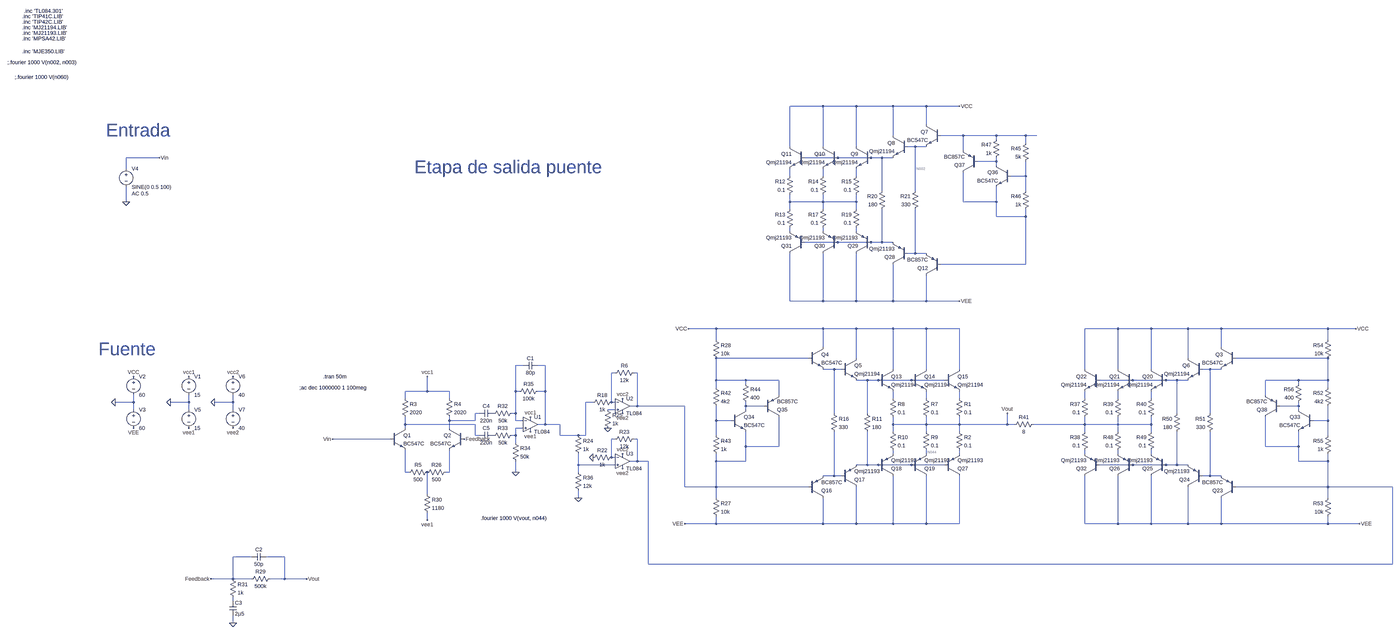
[diagram p0: schematic testV4.asc, whole sheet]
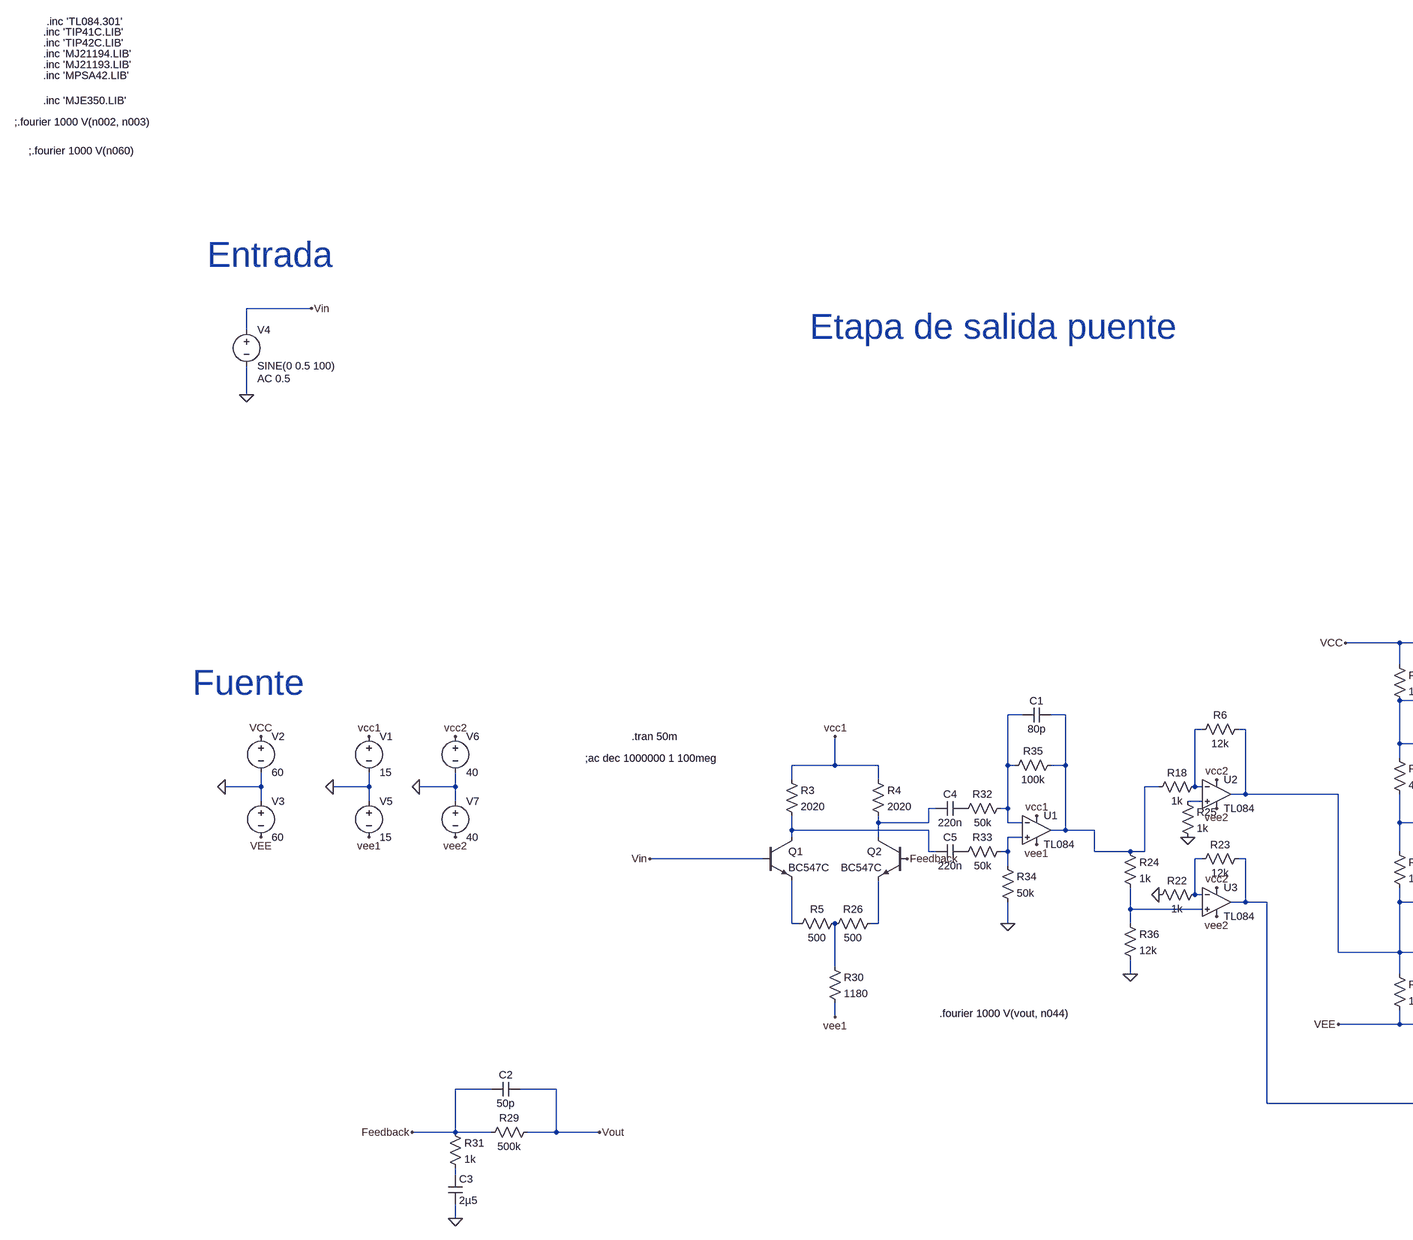
[diagram p1: schematic testV4.asc, part, row 1 of 1, column 1 of 2]
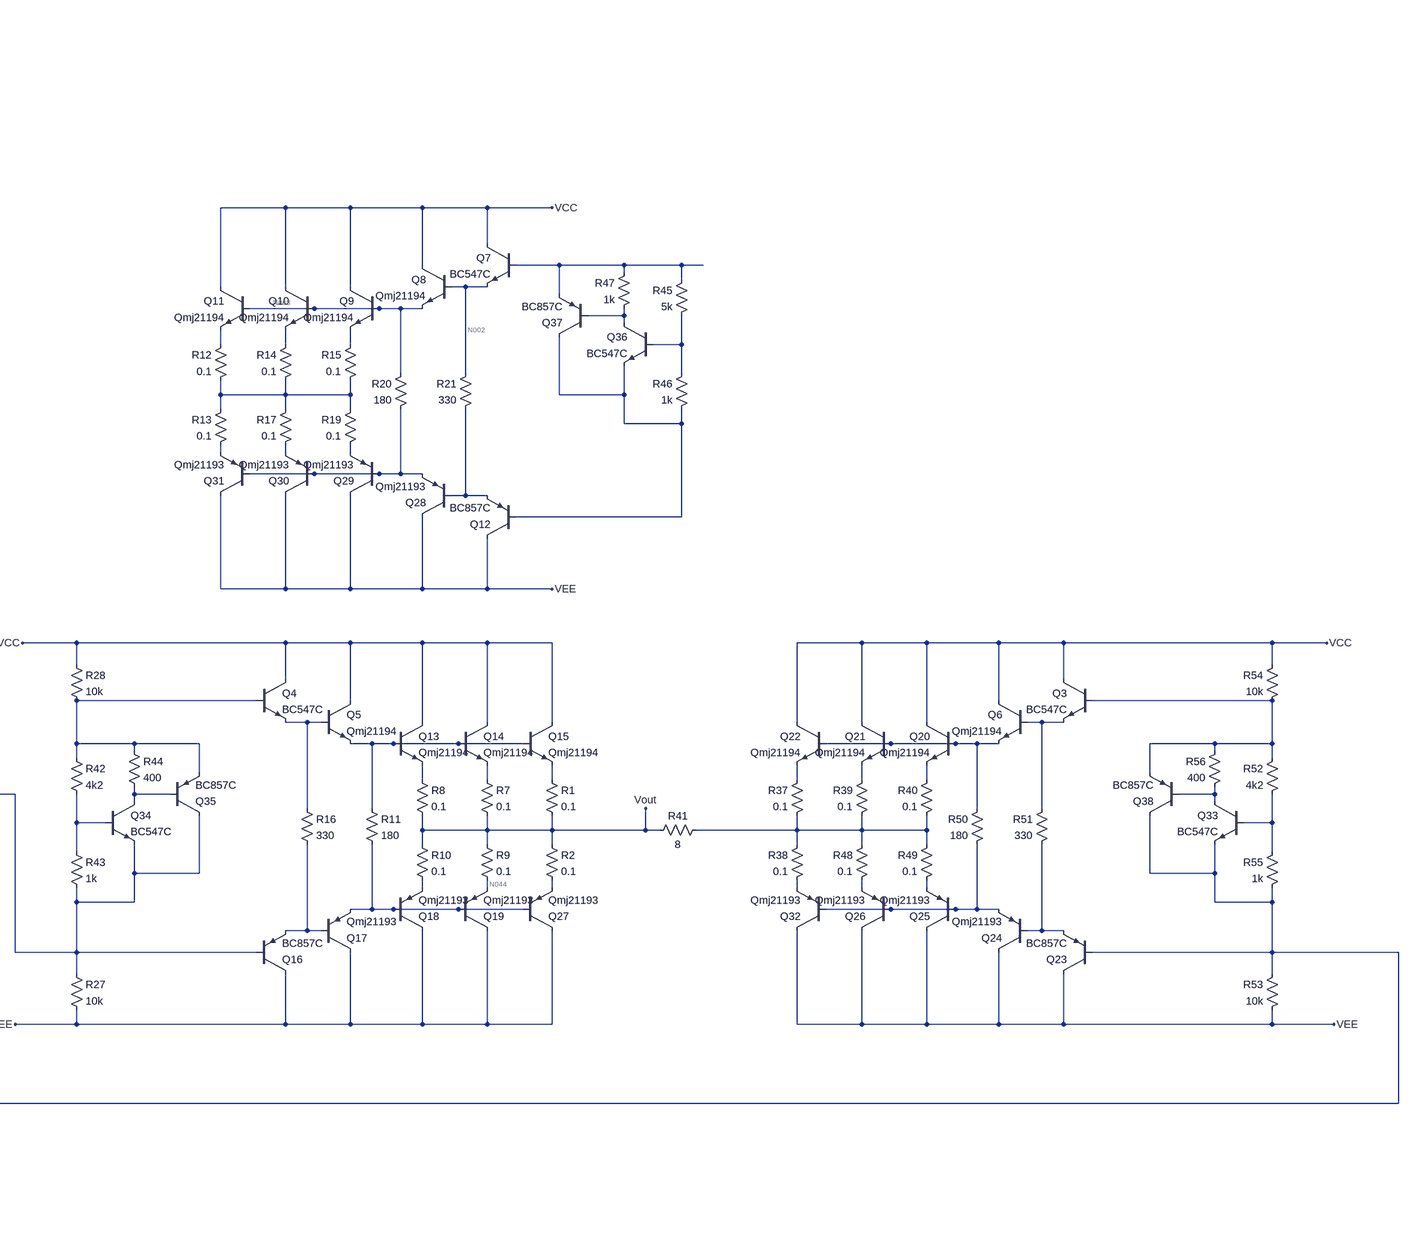
[diagram p2: schematic testV4.asc, part, row 1 of 1, column 2 of 2]
testV4.asc, the LTspice schematic file:
Version 4
SHEET 1 11584 2180
WIRE 6816 -288 6672 -288
WIRE 6960 -288 6816 -288
WIRE 7120 -288 6960 -288
WIRE 7264 -288 7120 -288
WIRE 7408 -288 7264 -288
WIRE 7264 -208 7264 -288
WIRE 7120 -160 7120 -288
WIRE 7424 -160 7328 -160
WIRE 7568 -160 7424 -160
WIRE 7696 -160 7568 -160
WIRE 7744 -160 7696 -160
WIRE 7568 -144 7568 -160
WIRE 7696 -128 7696 -160
WIRE 6672 -112 6672 -288
WIRE 6816 -112 6816 -288
WIRE 6960 -112 6960 -288
WIRE 7216 -112 7184 -112
WIRE 7264 -112 7216 -112
WIRE 7424 -96 7424 -160
WIRE 3760 -64 3616 -64
WIRE 6880 -64 6736 -64
WIRE 7024 -64 6880 -64
WIRE 7072 -64 7024 -64
WIRE 7120 -64 7072 -64
WIRE 7568 -48 7568 -64
WIRE 7568 -48 7488 -48
WIRE 7568 -32 7568 -48
WIRE 3616 -16 3616 -64
WIRE 6672 16 6672 -16
WIRE 6816 16 6816 -16
WIRE 6960 16 6960 -16
WIRE 7696 16 7696 -48
WIRE 7696 16 7632 16
WIRE 7072 80 7072 -64
WIRE 7216 80 7216 -112
WIRE 7696 80 7696 16
WIRE 3616 128 3616 64
WIRE 6672 128 6672 96
WIRE 6816 128 6816 96
WIRE 6816 128 6672 128
WIRE 6960 128 6960 96
WIRE 6960 128 6816 128
WIRE 7424 128 7424 0
WIRE 7568 128 7568 64
WIRE 7568 128 7424 128
WIRE 6672 160 6672 128
WIRE 6816 160 6816 128
WIRE 6960 160 6960 128
WIRE 7568 192 7568 128
WIRE 7696 192 7696 160
WIRE 7696 192 7568 192
WIRE 6672 256 6672 240
WIRE 6816 256 6816 240
WIRE 6960 256 6960 240
WIRE 6880 304 6736 304
WIRE 7024 304 6880 304
WIRE 7072 304 7072 160
WIRE 7072 304 7024 304
WIRE 7120 304 7072 304
WIRE 7216 352 7216 160
WIRE 7216 352 7184 352
WIRE 7264 352 7216 352
WIRE 7696 400 7696 192
WIRE 7696 400 7328 400
WIRE 6672 560 6672 352
WIRE 6816 560 6816 352
WIRE 6816 560 6672 560
WIRE 6960 560 6960 352
WIRE 6960 560 6816 560
WIRE 7120 560 7120 400
WIRE 7120 560 6960 560
WIRE 7264 560 7264 448
WIRE 7264 560 7120 560
WIRE 7408 560 7264 560
WIRE 6352 880 6208 880
WIRE 6816 880 6352 880
WIRE 6960 880 6816 880
WIRE 7120 880 6960 880
WIRE 7264 880 7120 880
WIRE 7408 880 7264 880
WIRE 8720 880 8576 880
WIRE 8864 880 8720 880
WIRE 9024 880 8864 880
WIRE 9168 880 9024 880
WIRE 9632 880 9168 880
WIRE 9776 880 9632 880
WIRE 6352 928 6352 880
WIRE 9632 928 9632 880
WIRE 6816 960 6816 880
WIRE 9168 960 9168 880
WIRE 6752 1008 6352 1008
WIRE 6960 1008 6960 880
WIRE 9024 1008 9024 880
WIRE 9632 1008 9232 1008
WIRE 5488 1040 5456 1040
WIRE 5584 1040 5552 1040
WIRE 6864 1056 6816 1056
WIRE 6896 1056 6864 1056
WIRE 7120 1056 7120 880
WIRE 7264 1056 7264 880
WIRE 7408 1056 7408 880
WIRE 8576 1056 8576 880
WIRE 8720 1056 8720 880
WIRE 8864 1056 8864 880
WIRE 9120 1056 9088 1056
WIRE 9168 1056 9120 1056
WIRE 5888 1072 5872 1072
WIRE 5984 1072 5968 1072
WIRE 6352 1104 6352 1008
WIRE 6480 1104 6352 1104
WIRE 6624 1104 6480 1104
WIRE 7008 1104 6960 1104
WIRE 7056 1104 7008 1104
WIRE 7200 1104 7056 1104
WIRE 7344 1104 7200 1104
WIRE 8784 1104 8640 1104
WIRE 8928 1104 8784 1104
WIRE 8976 1104 8928 1104
WIRE 9024 1104 8976 1104
WIRE 9504 1104 9360 1104
WIRE 9632 1104 9632 1008
WIRE 9632 1104 9504 1104
WIRE 6480 1120 6480 1104
WIRE 9504 1120 9504 1104
WIRE 6352 1136 6352 1104
WIRE 9632 1136 9632 1104
WIRE 5072 1152 5072 1088
WIRE 5072 1152 4976 1152
WIRE 5168 1152 5072 1152
WIRE 5456 1152 5456 1040
WIRE 5472 1152 5456 1152
WIRE 5584 1152 5584 1040
WIRE 5584 1152 5552 1152
WIRE 6624 1168 6624 1104
WIRE 9360 1168 9360 1104
WIRE 4976 1184 4976 1152
WIRE 5168 1184 5168 1152
WIRE 7120 1184 7120 1152
WIRE 7264 1184 7264 1152
WIRE 7408 1184 7408 1152
WIRE 8576 1184 8576 1152
WIRE 8720 1184 8720 1152
WIRE 8864 1184 8864 1152
WIRE 3648 1200 3648 1168
WIRE 3648 1200 3568 1200
WIRE 3888 1200 3888 1168
WIRE 3888 1200 3808 1200
WIRE 4080 1200 4080 1168
WIRE 4080 1200 4000 1200
WIRE 5792 1200 5760 1200
WIRE 5872 1200 5872 1072
WIRE 5888 1200 5872 1200
WIRE 5984 1216 5984 1072
WIRE 5984 1216 5952 1216
WIRE 6192 1216 5984 1216
WIRE 6480 1216 6480 1200
WIRE 6560 1216 6480 1216
WIRE 9504 1216 9504 1200
WIRE 9504 1216 9424 1216
WIRE 3648 1232 3648 1200
WIRE 3888 1232 3888 1200
WIRE 4080 1232 4080 1200
WIRE 5888 1232 5856 1232
WIRE 6480 1232 6480 1216
WIRE 9504 1232 9504 1216
WIRE 5296 1248 5280 1248
WIRE 5456 1248 5456 1152
WIRE 5456 1248 5440 1248
WIRE 6864 1248 6864 1056
WIRE 7008 1248 7008 1104
WIRE 8976 1248 8976 1104
WIRE 9120 1248 9120 1056
WIRE 5168 1280 5168 1264
WIRE 5280 1280 5280 1248
WIRE 5280 1280 5168 1280
WIRE 5456 1280 5456 1248
WIRE 5488 1280 5456 1280
WIRE 6352 1280 6352 1216
WIRE 6416 1280 6352 1280
WIRE 9632 1280 9632 1216
WIRE 9632 1280 9568 1280
WIRE 4976 1296 4976 1264
WIRE 5280 1296 4976 1296
WIRE 5584 1296 5584 1152
WIRE 5584 1296 5552 1296
WIRE 5648 1296 5584 1296
WIRE 7120 1296 7120 1264
WIRE 7264 1296 7264 1264
WIRE 7264 1296 7120 1296
WIRE 7408 1296 7408 1264
WIRE 7408 1296 7264 1296
WIRE 7616 1296 7616 1248
WIRE 7616 1296 7408 1296
WIRE 7648 1296 7616 1296
WIRE 8576 1296 8576 1264
WIRE 8576 1296 7728 1296
WIRE 8720 1296 8720 1264
WIRE 8720 1296 8576 1296
WIRE 8864 1296 8864 1264
WIRE 8864 1296 8720 1296
WIRE 4976 1312 4976 1296
WIRE 5168 1312 5168 1280
WIRE 5488 1312 5456 1312
WIRE 7120 1328 7120 1296
WIRE 7264 1328 7264 1296
WIRE 7408 1328 7408 1296
WIRE 8576 1328 8576 1296
WIRE 8720 1328 8720 1296
WIRE 8864 1328 8864 1296
WIRE 5280 1344 5280 1296
WIRE 5296 1344 5280 1344
WIRE 5456 1344 5456 1312
WIRE 5456 1344 5440 1344
WIRE 5648 1344 5648 1296
WIRE 5728 1344 5648 1344
WIRE 5760 1344 5760 1200
WIRE 5760 1344 5728 1344
WIRE 6352 1344 6352 1280
WIRE 9632 1344 9632 1280
WIRE 4912 1360 4512 1360
WIRE 5888 1360 5872 1360
WIRE 5984 1360 5968 1360
WIRE 5456 1376 5456 1344
WIRE 6480 1392 6480 1328
WIRE 6624 1392 6624 1264
WIRE 6624 1392 6480 1392
WIRE 9360 1392 9360 1264
WIRE 9504 1392 9504 1328
WIRE 9504 1392 9360 1392
WIRE 7120 1424 7120 1408
WIRE 7264 1424 7264 1408
WIRE 7408 1424 7408 1408
WIRE 8576 1424 8576 1408
WIRE 8720 1424 8720 1408
WIRE 8864 1424 8864 1408
WIRE 5872 1440 5872 1360
WIRE 5888 1440 5872 1440
WIRE 5984 1456 5984 1360
WIRE 5984 1456 5952 1456
WIRE 6032 1456 5984 1456
WIRE 6352 1456 6352 1424
WIRE 6480 1456 6480 1392
WIRE 6480 1456 6352 1456
WIRE 9504 1456 9504 1392
WIRE 9632 1456 9632 1424
WIRE 9632 1456 9504 1456
WIRE 5728 1472 5728 1424
WIRE 5888 1472 5728 1472
WIRE 7008 1472 7008 1328
WIRE 7008 1472 6960 1472
WIRE 7056 1472 7008 1472
WIRE 7200 1472 7056 1472
WIRE 7344 1472 7200 1472
WIRE 8784 1472 8640 1472
WIRE 8928 1472 8784 1472
WIRE 8976 1472 8976 1328
WIRE 8976 1472 8928 1472
WIRE 9024 1472 8976 1472
WIRE 4976 1504 4976 1408
WIRE 4992 1504 4976 1504
WIRE 5168 1504 5168 1408
WIRE 5168 1504 5152 1504
WIRE 5456 1504 5456 1456
WIRE 5728 1504 5728 1472
WIRE 6864 1520 6864 1328
WIRE 6864 1520 6816 1520
WIRE 6896 1520 6864 1520
WIRE 9120 1520 9120 1328
WIRE 9120 1520 9088 1520
WIRE 9168 1520 9120 1520
WIRE 6192 1568 6192 1216
WIRE 6352 1568 6352 1456
WIRE 6352 1568 6192 1568
WIRE 6752 1568 6352 1568
WIRE 9632 1568 9632 1456
WIRE 9632 1568 9232 1568
WIRE 9936 1568 9632 1568
WIRE 5072 1600 5072 1504
WIRE 5728 1616 5728 1584
WIRE 6352 1616 6352 1568
WIRE 9632 1616 9632 1568
WIRE 5072 1712 5072 1680
WIRE 6352 1728 6352 1696
WIRE 6352 1728 6192 1728
WIRE 6816 1728 6816 1616
WIRE 6816 1728 6352 1728
WIRE 6960 1728 6960 1568
WIRE 6960 1728 6816 1728
WIRE 7120 1728 7120 1520
WIRE 7120 1728 6960 1728
WIRE 7264 1728 7264 1520
WIRE 7264 1728 7120 1728
WIRE 7408 1728 7408 1520
WIRE 7408 1728 7264 1728
WIRE 8576 1728 8576 1520
WIRE 8720 1728 8720 1520
WIRE 8720 1728 8576 1728
WIRE 8864 1728 8864 1520
WIRE 8864 1728 8720 1728
WIRE 9024 1728 9024 1568
WIRE 9024 1728 8864 1728
WIRE 9168 1728 9168 1616
WIRE 9168 1728 9024 1728
WIRE 9632 1728 9632 1696
WIRE 9632 1728 9168 1728
WIRE 9792 1728 9632 1728
WIRE 4160 1872 4080 1872
WIRE 4304 1872 4224 1872
WIRE 6032 1904 6032 1456
WIRE 9936 1904 9936 1568
WIRE 9936 1904 6032 1904
WIRE 4080 1968 4080 1872
WIRE 4080 1968 3984 1968
WIRE 4160 1968 4080 1968
WIRE 4304 1968 4304 1872
WIRE 4304 1968 4240 1968
WIRE 4400 1968 4304 1968
WIRE 4080 2064 4080 2048
WIRE 4080 2160 4080 2128
FLAG 4080 2160 0
FLAG 3568 1200 0
FLAG 3616 128 0
FLAG 3760 -64 Vin
FLAG 3648 1088 VCC
FLAG 6208 880 VCC
FLAG 7408 -288 VCC
FLAG 3648 1312 VEE
FLAG 6192 1728 VEE
FLAG 7408 560 VEE
FLAG 3984 1968 Feedback
FLAG 4400 1968 Vout
FLAG 7616 1248 Vout
FLAG 4512 1360 Vin
FLAG 3808 1200 0
FLAG 3888 1088 vcc1
FLAG 3888 1312 vee1
FLAG 5856 1312 0
FLAG 5792 1440 0
FLAG 5072 1712 vee1
FLAG 5520 1328 vee1
FLAG 5920 1488 vee2
FLAG 5920 1248 vee2
FLAG 5072 1088 vcc1
FLAG 5520 1264 vcc1
FLAG 5920 1184 vcc2
FLAG 5920 1424 vcc2
FLAG 5456 1504 0
FLAG 4000 1200 0
FLAG 4080 1088 vcc2
FLAG 4080 1312 vee2
FLAG 5728 1616 0
FLAG 5232 1360 Feedback
FLAG 9776 880 VCC
FLAG 9792 1728 VEE
SYMBOL res 4256 1952 R90
WINDOW 0 0 56 VBottom 2
WINDOW 3 32 56 VTop 2
SYMATTR InstName R29
SYMATTR Value 500k
SYMBOL res 4064 1952 R0
SYMATTR InstName R31
SYMATTR Value 1k
SYMBOL cap 4224 1856 R90
WINDOW 0 0 32 VBottom 2
WINDOW 3 32 32 VTop 2
SYMATTR InstName C2
SYMATTR Value 50p
SYMBOL cap 4064 2064 R0
SYMATTR InstName C3
SYMATTR Value 2µ5
SYMBOL npn 6752 960 R0
SYMATTR InstName Q4
SYMATTR Value BC547C
SYMBOL npn 6896 1008 R0
SYMATTR InstName Q5
SYMATTR Value Qmj21194
SYMBOL npn 7056 1056 R0
SYMATTR InstName Q13
SYMATTR Value Qmj21194
SYMBOL npn 7200 1056 R0
SYMATTR InstName Q14
SYMATTR Value Qmj21194
SYMBOL npn 7344 1056 R0
SYMATTR InstName Q15
SYMATTR Value Qmj21194
SYMBOL pnp 6752 1616 M180
SYMATTR InstName Q16
SYMATTR Value BC857C
SYMBOL pnp 6896 1568 M180
SYMATTR InstName Q17
SYMATTR Value Qmj21193
SYMBOL pnp 7056 1520 M180
SYMATTR InstName Q18
SYMATTR Value Qmj21193
SYMBOL pnp 7200 1520 M180
SYMATTR InstName Q19
SYMATTR Value Qmj21193
SYMBOL pnp 7344 1520 M180
SYMATTR InstName Q27
SYMATTR Value Qmj21193
SYMBOL res 7392 1168 R0
SYMATTR InstName R1
SYMATTR Value 0.1
SYMBOL res 7392 1312 R0
SYMATTR InstName R2
SYMATTR Value 0.1
SYMBOL res 7248 1168 R0
SYMATTR InstName R7
SYMATTR Value 0.1
SYMBOL res 7104 1168 R0
SYMATTR InstName R8
SYMATTR Value 0.1
SYMBOL res 7248 1312 R0
SYMATTR InstName R9
SYMATTR Value 0.1
SYMBOL res 7104 1312 R0
SYMATTR InstName R10
SYMATTR Value 0.1
SYMBOL res 6992 1232 R0
SYMATTR InstName R11
SYMATTR Value 180
SYMBOL res 6848 1232 R0
SYMATTR InstName R16
SYMATTR Value 330
SYMBOL npn 7328 -208 M0
SYMATTR InstName Q7
SYMATTR Value BC547C
SYMBOL npn 7184 -160 M0
SYMATTR InstName Q8
SYMATTR Value Qmj21194
SYMBOL npn 7024 -112 M0
SYMATTR InstName Q9
SYMATTR Value Qmj21194
SYMBOL npn 6880 -112 M0
SYMATTR InstName Q10
SYMATTR Value Qmj21194
SYMBOL npn 6736 -112 M0
SYMATTR InstName Q11
SYMATTR Value Qmj21194
SYMBOL pnp 7328 448 R180
SYMATTR InstName Q12
SYMATTR Value BC857C
SYMBOL pnp 7184 400 R180
SYMATTR InstName Q28
SYMATTR Value Qmj21193
SYMBOL pnp 7024 352 R180
SYMATTR InstName Q29
SYMATTR Value Qmj21193
SYMBOL pnp 6880 352 R180
SYMATTR InstName Q30
SYMATTR Value Qmj21193
SYMBOL pnp 6736 352 R180
SYMATTR InstName Q31
SYMATTR Value Qmj21193
SYMBOL res 6688 0 M0
SYMATTR InstName R12
SYMATTR Value 0.1
SYMBOL res 6688 144 M0
SYMATTR InstName R13
SYMATTR Value 0.1
SYMBOL res 6832 0 M0
SYMATTR InstName R14
SYMATTR Value 0.1
SYMBOL res 6976 0 M0
SYMATTR InstName R15
SYMATTR Value 0.1
SYMBOL res 6832 144 M0
SYMATTR InstName R17
SYMATTR Value 0.1
SYMBOL res 6976 144 M0
SYMATTR InstName R19
SYMATTR Value 0.1
SYMBOL res 7088 64 M0
SYMATTR InstName R20
SYMATTR Value 180
SYMBOL res 7232 64 M0
SYMATTR InstName R21
SYMATTR Value 330
SYMBOL res 7744 1280 R90
WINDOW 0 0 56 VBottom 2
WINDOW 3 32 56 VTop 2
SYMATTR InstName R41
SYMATTR Value 8
SYMBOL npn 6416 1232 R0
SYMATTR InstName Q34
SYMATTR Value BC547C
SYMBOL res 6336 1120 R0
SYMATTR InstName R42
SYMATTR Value 4k2
SYMBOL res 6336 1328 R0
SYMATTR InstName R43
SYMATTR Value 1k
SYMBOL res 6464 1104 R0
SYMATTR InstName R44
SYMATTR Value 400
SYMBOL pnp 6560 1264 M180
SYMATTR InstName Q35
SYMATTR Value BC857C
SYMBOL npn 7632 -32 M0
SYMATTR InstName Q36
SYMATTR Value BC547C
SYMBOL res 7712 -144 M0
SYMATTR InstName R45
SYMATTR Value 5k
SYMBOL res 7712 64 M0
SYMATTR InstName R46
SYMATTR Value 1k
SYMBOL res 7584 -160 M0
SYMATTR InstName R47
SYMATTR Value 1k
SYMBOL pnp 7488 0 R180
SYMATTR InstName Q37
SYMATTR Value BC857C
SYMBOL voltage 3648 1072 R0
WINDOW 123 0 0 Left 0
WINDOW 39 24 44 Left 2
SYMATTR InstName V2
SYMATTR Value 60
SYMBOL voltage 3648 1216 R0
WINDOW 123 0 0 Left 0
WINDOW 39 24 124 Left 2
SYMATTR InstName V3
SYMATTR Value 60
SYMBOL voltage 3616 -32 R0
WINDOW 123 24 124 Left 2
WINDOW 39 0 0 Left 0
SYMATTR Value2 AC 0.5
SYMATTR InstName V4
SYMATTR Value SINE(0 0.5 100)
SYMBOL voltage 3888 1072 R0
WINDOW 123 0 0 Left 0
WINDOW 39 24 44 Left 2
SYMATTR InstName V1
SYMATTR Value 15
SYMBOL voltage 3888 1216 R0
WINDOW 123 0 0 Left 0
WINDOW 39 24 124 Left 2
SYMATTR InstName V5
SYMATTR Value 15
SYMBOL Opamps\\opamp2 5920 1152 R0
SYMATTR InstName U2
SYMATTR Value TL084
SYMBOL Opamps\\opamp2 5920 1392 R0
SYMATTR InstName U3
SYMATTR Value TL084
SYMBOL res 5984 1056 R90
WINDOW 0 0 56 VBottom 2
WINDOW 3 32 56 VTop 2
SYMATTR InstName R6
SYMATTR Value 12k
SYMBOL res 5888 1184 R90
WINDOW 0 0 56 VBottom 2
WINDOW 3 32 56 VTop 2
SYMATTR InstName R18
SYMATTR Value 1k
SYMBOL res 5888 1424 R90
WINDOW 0 0 56 VBottom 2
WINDOW 3 32 56 VTop 2
SYMATTR InstName R22
SYMATTR Value 1k
SYMBOL res 5984 1344 R90
WINDOW 0 0 56 VBottom 2
WINDOW 3 32 56 VTop 2
SYMATTR InstName R23
SYMATTR Value 12k
SYMBOL res 5712 1328 R0
SYMATTR InstName R24
SYMATTR Value 1k
SYMBOL res 5840 1216 R0
SYMATTR InstName R25
SYMATTR Value 1k
SYMBOL npn 4912 1312 R0
SYMATTR InstName Q1
SYMATTR Value BC547C
SYMBOL npn 5232 1312 M0
SYMATTR InstName Q2
SYMATTR Value BC547C
SYMBOL res 4960 1168 R0
SYMATTR InstName R3
SYMATTR Value 2020
SYMBOL res 5152 1168 R0
SYMATTR InstName R4
SYMATTR Value 2020
SYMBOL res 5088 1488 R90
WINDOW 0 0 56 VBottom 2
WINDOW 3 32 56 VTop 2
SYMATTR InstName R5
SYMATTR Value 500
SYMBOL res 5168 1488 R90
WINDOW 0 0 56 VBottom 2
WINDOW 3 32 56 VTop 2
SYMATTR InstName R26
SYMATTR Value 500
SYMBOL res 5056 1584 R0
SYMATTR InstName R30
SYMATTR Value 1180
SYMBOL Opamps\\opamp2 5520 1232 R0
SYMATTR InstName U1
SYMATTR Value TL084
SYMBOL res 5456 1232 R90
WINDOW 0 0 56 VBottom 2
WINDOW 3 32 56 VTop 2
SYMATTR InstName R32
SYMATTR Value 50k
SYMBOL res 5456 1328 R90
WINDOW 0 0 56 VBottom 2
WINDOW 3 32 56 VTop 2
SYMATTR InstName R33
SYMATTR Value 50k
SYMBOL res 5440 1360 R0
SYMATTR InstName R34
SYMATTR Value 50k
SYMBOL res 5568 1136 R90
WINDOW 0 0 56 VBottom 2
WINDOW 3 32 56 VTop 2
SYMATTR InstName R35
SYMATTR Value 100k
SYMBOL cap 5552 1024 R90
WINDOW 0 0 32 VBottom 2
WINDOW 3 32 32 VTop 2
SYMATTR InstName C1
SYMATTR Value 80p
SYMBOL cap 5360 1232 R90
WINDOW 0 0 32 VBottom 2
WINDOW 3 32 32 VTop 2
SYMATTR InstName C4
SYMATTR Value 220n
SYMBOL cap 5360 1328 R90
WINDOW 0 0 32 VBottom 2
WINDOW 3 32 32 VTop 2
SYMATTR InstName C5
SYMATTR Value 220n
SYMBOL voltage 4080 1072 R0
WINDOW 123 0 0 Left 0
WINDOW 39 24 44 Left 2
SYMATTR InstName V6
SYMATTR Value 40
SYMBOL voltage 4080 1216 R0
WINDOW 123 0 0 Left 0
WINDOW 39 24 124 Left 2
SYMATTR InstName V7
SYMATTR Value 40
SYMBOL res 5712 1488 R0
SYMATTR InstName R36
SYMATTR Value 12k
SYMBOL res 6336 1600 R0
SYMATTR InstName R27
SYMATTR Value 10k
SYMBOL res 6336 912 R0
SYMATTR InstName R28
SYMATTR Value 10k
SYMBOL npn 9232 960 M0
SYMATTR InstName Q3
SYMATTR Value BC547C
SYMBOL npn 9088 1008 M0
SYMATTR InstName Q6
SYMATTR Value Qmj21194
SYMBOL npn 8928 1056 M0
SYMATTR InstName Q20
SYMATTR Value Qmj21194
SYMBOL npn 8784 1056 M0
SYMATTR InstName Q21
SYMATTR Value Qmj21194
SYMBOL npn 8640 1056 M0
SYMATTR InstName Q22
SYMATTR Value Qmj21194
SYMBOL pnp 9232 1616 R180
SYMATTR InstName Q23
SYMATTR Value BC857C
SYMBOL pnp 9088 1568 R180
SYMATTR InstName Q24
SYMATTR Value Qmj21193
SYMBOL pnp 8928 1520 R180
SYMATTR InstName Q25
SYMATTR Value Qmj21193
SYMBOL pnp 8784 1520 R180
SYMATTR InstName Q26
SYMATTR Value Qmj21193
SYMBOL pnp 8640 1520 R180
SYMATTR InstName Q32
SYMATTR Value Qmj21193
SYMBOL res 8592 1168 M0
SYMATTR InstName R37
SYMATTR Value 0.1
SYMBOL res 8592 1312 M0
SYMATTR InstName R38
SYMATTR Value 0.1
SYMBOL res 8736 1168 M0
SYMATTR InstName R39
SYMATTR Value 0.1
SYMBOL res 8880 1168 M0
SYMATTR InstName R40
SYMATTR Value 0.1
SYMBOL res 8736 1312 M0
SYMATTR InstName R48
SYMATTR Value 0.1
SYMBOL res 8880 1312 M0
SYMATTR InstName R49
SYMATTR Value 0.1
SYMBOL res 8992 1232 M0
SYMATTR InstName R50
SYMATTR Value 180
SYMBOL res 9136 1232 M0
SYMATTR InstName R51
SYMATTR Value 330
SYMBOL res 9648 1600 M0
SYMATTR InstName R53
SYMATTR Value 10k
SYMBOL res 9648 912 M0
SYMATTR InstName R54
SYMATTR Value 10k
SYMBOL npn 9568 1232 M0
SYMATTR InstName Q33
SYMATTR Value BC547C
SYMBOL res 9648 1120 M0
SYMATTR InstName R52
SYMATTR Value 4k2
SYMBOL res 9648 1328 M0
SYMATTR InstName R55
SYMATTR Value 1k
SYMBOL res 9520 1104 M0
SYMATTR InstName R56
SYMATTR Value 400
SYMBOL pnp 9424 1264 R180
SYMATTR InstName Q38
SYMATTR Value BC857C
TEXT -568 -744 Left 2 !.inc 'TL084.301'
TEXT -576 -720 Left 2 !.inc 'TIP41C.LIB'
TEXT -640 -520 Left 2 !;.fourier 1000 V(n002, n003)
TEXT 4472 1088 Left 2 !.tran 50m
TEXT -576 -696 Left 2 !.inc 'TIP42C.LIB'
TEXT -576 -672 Left 2 !.inc 'MJ21194.LIB'
TEXT -576 -648 Left 2 !.inc 'MJ21193.LIB'
TEXT -576 -624 Left 2 !.inc 'MPSA42.LIB'
TEXT -576 -568 Left 2 !.inc 'MJE350.LIB'
TEXT -608 -456 Left 2 !;.fourier 1000 V(n060)
TEXT 5016 -24 Left 6 ;Etapa de salida puente
TEXT 3496 968 Left 6 ;Fuente
TEXT 3528 -184 Left 6 ;Entrada
TEXT 4368 1136 Left 2 !;ac dec 1000000 1 100meg
TEXT 5304 1704 Left 2 !.fourier 1000 V(vout, n044)

The netlist it stands for:
* testV4.asc
R29 Vout Feedback 500k
R31 Feedback N057 1k
C2 Vout Feedback 50p
C3 N057 0 2µ5
Q4 VCC N016 N020 0 BC547C
Q5 VCC N020 N024 0 Qmj21194
Q13 VCC N024 N026 0 Qmj21194
Q14 VCC N024 N027 0 Qmj21194
Q15 VCC N024 N028 0 Qmj21194
Q16 VEE N023 N054 0 BC857C
Q17 VEE N054 N050 0 Qmj21193
Q18 VEE N050 N043 0 Qmj21193
Q19 VEE N050 N044 0 Qmj21193
Q27 VEE N050 N045 0 Qmj21193
R1 N028 Vout 0.1
R2 Vout N045 0.1
R7 N027 Vout 0.1
R8 N026 Vout 0.1
R9 Vout N044 0.1
R10 Vout N043 0.1
R11 N024 N050 180
R16 N020 N054 330
Q7 VCC N001 N002 0 BC547C
Q8 VCC N002 N003 0 Qmj21194
Q9 VCC N003 N007 0 Qmj21194
Q10 VCC N003 N006 0 Qmj21194
Q11 VCC N003 N005 0 Qmj21194
Q12 VEE N010 N015 0 BC857C
Q28 VEE N015 N014 0 Qmj21193
Q29 VEE N014 N013 0 Qmj21193
Q30 VEE N014 N012 0 Qmj21193
Q31 VEE N014 N011 0 Qmj21193
R12 N005 N009 0.1
R13 N009 N011 0.1
R14 N006 N009 0.1
R15 N007 N009 0.1
R17 N009 N012 0.1
R19 N009 N013 0.1
R20 N003 N014 180
R21 N002 N015 330
R41 N039 Vout 8
Q34 N032 N036 N023 0 BC547C
R42 N016 N036 4k2
R43 N036 N023 1k
R44 N016 N032 400
Q35 N023 N032 N016 0 BC857C
Q36 N004 N008 N010 0 BC547C
R45 N001 N008 5k
R46 N008 N010 1k
R47 N001 N004 1k
Q37 N010 N004 N001 0 BC857C
V2 VCC 0 60
V3 0 VEE 60
V4 Vin 0 SINE(0 0.5 100) AC 0.5
V1 vcc1 0 15
V5 0 vee1 15
XU2 N034 N022 vcc2 vee2 N023 TL084  ; pins In+ In- V+ V- OUT
XU3 N049 N041 vcc2 vee2 N042 TL084  ; pins In+ In- V+ V- OUT
R6 N023 N022 12k
R18 N022 N019 1k
R22 N041 0 1k
R23 N042 N041 12k
R24 N019 N049 1k
R25 N034 0 1k
Q1 N038 Vin N052 0 BC547C
Q2 N035 Feedback N053 0 BC547C
R3 vcc1 N038 2020
R4 vcc1 N035 2020
R5 N056 N052 500
R26 N053 N056 500
R30 N056 vee1 1180
XU1 N040 N018 vcc1 vee1 N019 TL084  ; pins In+ In- V+ V- OUT
R32 N018 P001 50k
R33 N040 P002 50k
R34 N040 0 50k
R35 N019 N018 100k
C1 N019 N018 80p
C4 P001 N035 220n
C5 P002 N038 220n
V6 vcc2 0 40
V7 0 vee2 40
R36 N049 0 12k
R27 N023 VEE 10k
R28 VCC N016 10k
Q3 VCC N017 N021 0 BC547C
Q6 VCC N021 N025 0 Qmj21194
Q20 VCC N025 N031 0 Qmj21194
Q21 VCC N025 N030 0 Qmj21194
Q22 VCC N025 N029 0 Qmj21194
Q23 VEE N042 N055 0 BC857C
Q24 VEE N055 N051 0 Qmj21193
Q25 VEE N051 N048 0 Qmj21193
Q26 VEE N051 N047 0 Qmj21193
Q32 VEE N051 N046 0 Qmj21193
R37 N029 N039 0.1
R38 N039 N046 0.1
R39 N030 N039 0.1
R40 N031 N039 0.1
R48 N039 N047 0.1
R49 N039 N048 0.1
R50 N025 N051 180
R51 N021 N055 330
R53 N042 VEE 10k
R54 VCC N017 10k
Q33 N033 N037 N042 0 BC547C
R52 N017 N037 4k2
R55 N037 N042 1k
R56 N017 N033 400
Q38 N042 N033 N017 0 BC857C
.model NPN NPN
.model PNP PNP
.lib standard.bjt
.inc 'TL084.301'
.inc 'TIP41C.LIB'
;.fourier 1000 V(n002, n003)
.tran 50m
.inc 'TIP42C.LIB'
.inc 'MJ21194.LIB'
.inc 'MJ21193.LIB'
.inc 'MPSA42.LIB'
.inc 'MJE350.LIB'
;.fourier 1000 V(n060)
* Etapa de salida puente
* Fuente
* Entrada
;ac dec 1000000 1 100meg
.fourier 1000 V(vout, n044)
.backanno
.end